# EasyEDA Pro project ProProject_audio_project_2024-04-28.epro

# Schematic Schematic1
Create Date: 2024-04-14; Page Name: P1; Project Name: audio_project; Schematic Name: Schematic1; Update Date: 2024-04-19; Company: 嘉立创EDA; Page Size: A4; Version: V1.0
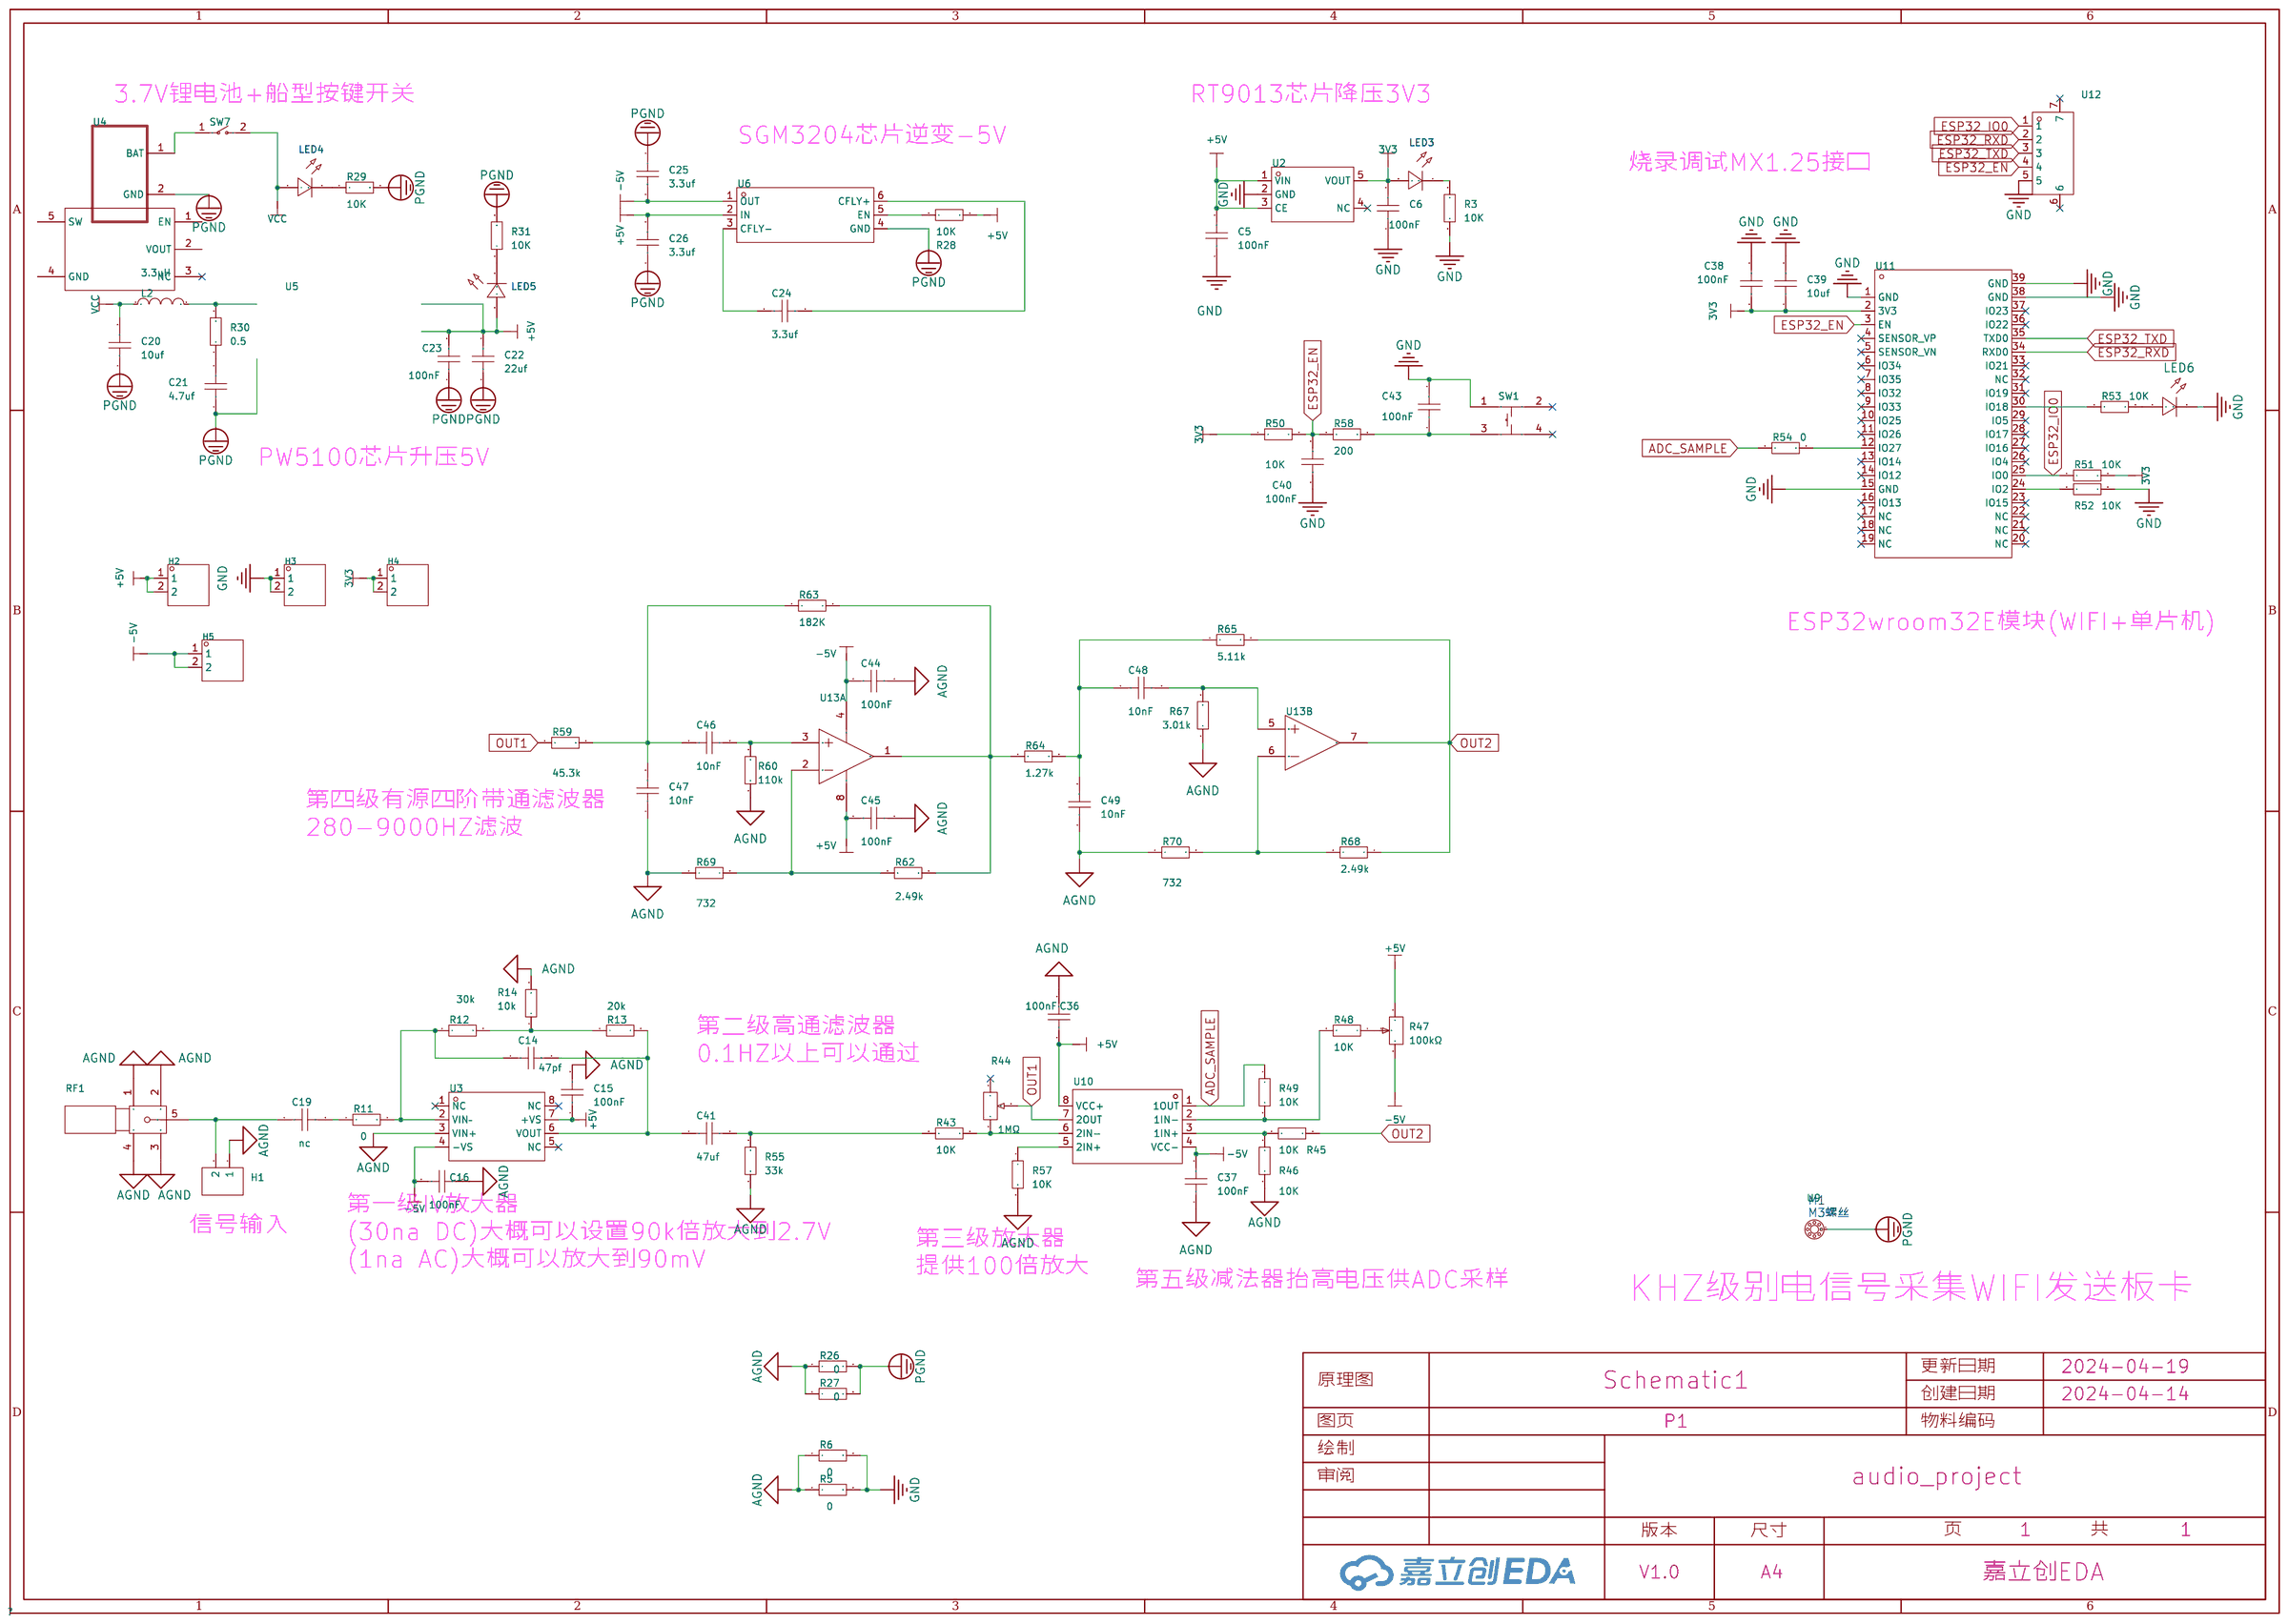
[diagram p0: schematic sheet]

## Parts
C5  100nF  [C0603]
C6  100nF  [C0603]
C14  47pf  [C0603]
C15  100nF  [C0603]
C16  100nF  [C0603]
C19  nc  [C0603]
C20  10uf  [C0805]
C21  4.7uf  [C0603]
C22  22uf  [C0805]
C23  100nF  [C0603]
C24  3.3uf  [C0603]
C25  3.3uf  [C0603]
C26  3.3uf  [C0603]
C36  100nF  [C0603]
C37  100nF  [C0603]
C38  100nF  [C0603]
C39  10uf  [C0805]
C40  100nF  [C0603]
C41  47uf  [C0805]
C43  100nF  [C0603]
C44  100nF  [C0603]
C45  100nF  [C0603]
C46  10nF  [C0603]
C47  10nF  [C0603]
C48  10nF  [C0603]
C49  10nF  [C0603]
H1  -  [HDR-TH_2P-P2.54-V-F]
H2  -  [HDR-TH_2P-P2.54-V-M-1]
H3  -  [HDR-TH_2P-P2.54-V-M-1]
H4  -  [HDR-TH_2P-P2.54-V-M-1]
H5  -  [HDR-TH_2P-P2.54-V-M-1]
L2  3.3uH  [IND-SMD_L4.0-W4.0_FNR40XXS]
LED3  -  [LED_0805]
LED4  -  [LED_0805]
LED5  -  [LED_0805]
LED6  -  [LED_0805]
R3  10K  [R0603]
R5  0  [R0603]
R6  0  [R0603]
R11  0  [R0603]
R12  30k  [R0603]
R13  20k  [R0603]
R14  10k  [R0603]
R26  0  [R0603]
R27  0  [R0603]
R28  10K  [R0603]
R29  10K  [R0603]
R30  0.5  [R0603]
R31  10K  [R0603]
R43  10K  [R0603]
R44  1MΩ  [RES-ADJ-TH_3P-L7.1-W6.9-P2.50-L_3362P]
R45  10K  [R0603]
R46  10K  [R0603]
R47  100kΩ  [RES-ADJ-TH_3296W]
R48  10K  [R0603]
R49  10K  [R0603]
R50  10K  [R0603]
R51  10K  [R0603]
R52  10K  [R0603]
R53  10K  [R0603]
R54  0  [R0603]
R55  33k  [R0603]
R57  10K  [R0603]
R58  200  [R0603]
R59  45.3k  [R0603]
R60  110k  [R0603]
R62  2.49k  [R0603]
R63  182K  [R0603]
R64  1.27k  [R0603]
R65  5.11k  [R0603]
R67  3.01k  [R0603]
R68  2.49k  [R0603]
R69  732  [R0805]
R70  732  [R0805]
RF1  BWSMA-KWE-Z001  [SMA-TH_BWSMA-KWE-Z001]
SW1  K2-1808SN-A3SW-01  [SW-SMD_4P-L4.2-W3.3-P2.15-LS5.1]
SW7  KCD11-2P-R  [SW-TH_2P-L15.0-W10.5-P5.00_KCD11-2P-R]
U2  RT9013-33GB-MS  [SOT-23-5_L2.9-W1.6-P0.95-LS2.8-BR]
U3  OPA657U  [SOIC-8_L4.9-W3.9-P1.27-LS6.0-TL]
U4  -  [两个焊盘]
U5  3c0bada92d29401ea73ee46ec49cffd6  [SOT-23-5_L2.9-W1.6-P0.95-LS2.8-TL]
U6  SGM3204YN6G/TR  [SOT-23-6_L2.9-W1.6-P0.95-LS2.8-BR]
U9  -  [m3]
U10  LF353DR  [SOIC-8_L5.0-W4.0-P1.27-LS6.0-BL]
U11  ESP32-WROOM-32E  [WIFI-SMD_ESP32-WROOM-32E-A]
U12  ZX-MX1.25-5PLT  [CONN-SMD_5P-P1.25_MEGASTAR_ZX-MX1.25-5PLT]
U13  OPA2182IDR  [SOIC-8_L4.9-W3.9-P1.27-LS6.0-BL]  (sections 1,2)

## Library data of the parts
C5 C6 C14-C16 C19 C21 C23-C26 C36-C38 C40 C43-C49 = CAP_0603: Supplier Footprint: 0603
C20 C22 C39 C41 = CAP_0805: Supplier Footprint: 0805
H1 = HDR-F_2.54_1x2P: Supplier Part: C49661; Supplier Footprint: 插件
H2-H5 = HDR-M_2.54_1x2P: Supplier Part: C124375; Supplier Footprint: 插件
L2 = FNR4030S3R3MT: 电感值:3.3uH;精度:±20%;额定电流:2.6A;饱和电流(Isat):3.6A;; LCSC Part Name: 3.3uH ±20% 3.6A; Supplier Part: C167870; Manufacturer: cjiang(长江微电); Supplier Footprint: SMD,4x4mm; JLCPCB Part Class: 扩展库; Datasheet: https://atta.szlcsc.com/upload/public/pdf/source/20190327/C167925_9EFF0AABC4CA629C2CC95961DBF7D39D.pdf; Supplier: LCSC; Tolerance: ±20%; Rated Current: 2.6A; Saturation Current (Isat): 3.6A; DC Resistance (DCR): 52mΩ
LED3-LED5 = LED_0805-G: Supplier Footprint: 0805
LED6 = LED_0805-R: Supplier Footprint: 0805
R3 R5 R6 R11-R14 R26-R31 R43 R45 R46 R48-R55 R57-R60 R62-R65 R67 R68 = Res_0603: Supplier Footprint: 0603
R44 = 3362P-1-105: 阻值:1MΩ;精度:±10%;; LCSC Part Name: 1MΩ ±10%; Supplier Part: C118945; Manufacturer: BOCHEN(博晨); Supplier Footprint: 插件; JLCPCB Part Class: 扩展库; Datasheet: https://atta.szlcsc.com/upload/public/pdf/source/20171114/C118945_15106326627791117434.pdf; Supplier: LCSC; Tolerance: ±10%
R47 = 3296W-1-104LF: 阻值:100kΩ;精度:±10%;; LCSC Part Name: 100kΩ ±10%; Supplier Part: C48084; Manufacturer: BOURNS; Supplier Footprint: 插件; JLCPCB Part Class: 扩展库; Datasheet: https://atta.szlcsc.com/upload/public/pdf/source/20150811/1457707339453.pdf; Supplier: LCSC; Tolerance: ±10%
R69 R70 = Res_0805: Supplier Footprint: 0805
RF1 = BWSMA-KWE-Z001: 连接器类型:板端;接口类型:内孔;端口数量:1;接口直径:5.3mm;接口长度/高度:-;频率-最大值:-;射频系列:SMA;阻抗:50Ω;样式:弯头;触头材质:-;触头镀层:-;工作温度范围:-;焊接温度(最大值):-;; LCSC Part Name: 内孔 SMA 弯头; Supplier Part: C496551; Manufacturer: BAT WIRELESS(蝙蝠无线); Supplier Footprint: 插件; JLCPCB Part Class: 扩展库; Datasheet: https://atta.szlcsc.com/upload/public/pdf/source/20231017/997A8C2ADA7F8034A89BE1264F38CE52.pdf; Supplier: LCSC; Connector Type: 板端; Interface Type: 内孔; Number of Ports: 1; Interface Diameter: 5.3mm; RF Series: SMA; Impedance: 50Ω; Style: 弯头
SW1 = K2-1808SN-A3SW-01: 触点电流:50mA;额定电压(DC):12V;绝缘电阻:100MΩ;安装方式:立贴;作用力:180gf@±30gf;机械寿命:100000;工作温度:-25℃~+85℃;开关长度:4.2mm;开关宽度:3.25mm;开关高度:2.5mm;; LCSC Part Name: 3*4*2.5 贴片开关180G; Supplier Part: C2690012; Manufacturer: 韩国韩荣; Supplier Footprint: SMD; JLCPCB Part Class: 扩展库; Datasheet: https://atta.szlcsc.com/upload/public/pdf/source/20180927/C283535_7E7907F3E7B6C1691E1DC87E363D082A.pdf; Supplier: LCSC; Contact Current: 50mA; Voltage Rating (DC): 12V; Insulation Resistance: 100MΩ; Mounting Sytle: 立贴; Operating Force: 180gf@±30gf; Mechanical Life: 100000; Operating Temperature: -25℃~+85℃; Switch Length: 4.2mm; Switch Width: 3.25mm; Switch Height: 2.5mm
SW7 = KCD11-2P-R: 带灯:无;引脚样式:焊片;额定电流:3A;额定电压(AC):250V;额定电压(DC):-;电路结构:单刀单掷;机械寿命:1万次;; LCSC Part Name: 10.5*15mm 两脚两档跷板开关 红钮; Supplier Part: C5884414; Manufacturer: SHOU HAN(首韩); Supplier Footprint: 插件; JLCPCB Part Class: 扩展库; Datasheet: https://atta.szlcsc.com/upload/public/pdf/source/20230506/CD06DFDE35C8048D34175BFF4AF6A2C2.pdf; Supplier: LCSC; Switch Length: 15mm; Switch Width: 10.5mm; Switch Height: 17.2mm; Actuator Type: 凹面弯曲; With Lamp: 无; Pin Style: 焊片; Actuator Color: 红色; Contact Current: 3A; Voltage Rating (AC): 250V; Circuit: 单刀单掷; Mechanical Life: 1万次; Operating Temperature: 0℃~+125℃; Actuator Identifier: - O
U2 = RT9013-33GB-MS: 输出类型:固定;最大输入电压:5.5V;输出电压:3.3V;输出电流:500mA;电源纹波抑制比(PSRR):75dB@(1kHz);输出极性:正极;; Supplier Part: C7434207; Manufacturer: MSKSEMI(美森科); Supplier Footprint: SOT-23-5; JLCPCB Part Class: 扩展库; Datasheet: https://atta.szlcsc.com/upload/public/pdf/source/20230705/1D6536D82D93AC1E044F3DAE104751D9.pdf; Supplier: LCSC; Output Type: 固定; Maximum Input Voltage: 5.5V; Output Voltage: 3.3V; Output Current: 500mA; Power Supply Rejection Ratio (PSRR): 75dB@(1kHz); Output Polarity: 正极
U3 = OPA657U: 1.6GHz、低噪声、FET 输入运算放大器 8-SOIC -40 to 85; Supplier Part: C2878144; Manufacturer: TI(德州仪器); Supplier Footprint: SOIC-8; JLCPCB Part Class: 扩展库; Supplier: LCSC
U4 = 两个焊盘
U5 = PW5100: 锂电池DC-DC高效同步升压变换器
U6 = SGM3204YN6G/TR: 功能类型:电荷泵;输入电压:1.4V~5.5V;输出电压:-5.5V~-1.4V;输出电流(最大值):200mA;; Supplier Part: C194031; Manufacturer: SGMICRO(圣邦微); Supplier Footprint: SOT-23-6; JLCPCB Part Class: 扩展库; Datasheet: https://atta.szlcsc.com/upload/public/pdf/source/20180627/C194031_755051E53122D645C36CF727711B963E.pdf; Supplier: LCSC; Function: 电荷泵; Input Voltage: 1.4V~5.5V; Output Voltage: -5.5V~-1.4V; Output Current (Max): 200mA; Switching Frequency: 950kHz; Number of Outputs: 1
U9 = M3焊盘
U10 = LF353DR: 运放类型:J-FET;放大器组数:2;增益带宽积（GBP）:3MHz;压摆率（SR）:13 V/us;电源电压:±3.5V ~ 18V;各通道供电电流:3.6mA;; Supplier Part: C7918; Manufacturer: TI(德州仪器); Supplier Footprint: SOIC-8-150mil; JLCPCB Part Class: 扩展库; Datasheet: https://atta.szlcsc.com/upload/public/pdf/source/20180308/C7918_15204885487891413793.pdf; Supplier: LCSC; Amplifier Type: J-FET; Number of Circuits: 2; Gain Bandwidth Product（GBP）: 3MHz; Slew Rate（SR）: 13 V/us; Supply Voltage（Single）: ±3.5V ~ 18V; Iq per channel (Typ): 3.6mA; Operating Temperature: 0°C ~ 70°C
U11 = ESP32-WROOM-32E: Supplier Part: C2973652; Manufacturer: ESPRESSIF(乐鑫); Supplier Footprint: SMD,18x25.5mm; JLCPCB Part Class: Extended Part; Datasheet: https://atta.szlcsc.com/upload/public/pdf/source/20220506/2B7DF1E5B41DABC7447F735C715CAF22.pdf; Supplier: LCSC
U12 = ZX-MX1.25-5PLT: 插针结构:1x5P;间距:1.25mm;安装方式:立贴;参考系列:-;总PIN数:5P;排数:1;每排PIN数:5;行距:-;额定电流:1A;触头材质:黄铜;触头镀层:锡;工作温度范围:-25℃~+85℃;; LCSC Part Name: 1x5P 间距:1.25mm 立贴; Supplier Part: C7430476; Manufacturer: Megastar(兆星); Supplier Footprint: SMD,P=1.25mm; JLCPCB Part Class: 扩展库; Datasheet: https://atta.szlcsc.com/upload/public/pdf/source/20230619/51DE3896F53EA722A95969B8F38DD13F.pdf; Supplier: LCSC; Pins Structure: 1x5P; Pitch: 1.25mm; Mounting Style: 立贴; Number of Pins: 5P; Number of Rows: 1; Number of PINs Per Row: 5; Current Rating (Max): 1A; Contact Material: 黄铜; Contact Plating: 锡; Operating Temperature Range: -25℃~+85℃
U13 = OPA2182IDR: 放大器数:双路;增益带宽积(GBP):5MHz;输入偏置电流(Ib):50pA;输入失调电压(Vos):450nV;压摆率(SR):10V/us;带宽(-3db):-;轨到轨:-;; Supplier Part: C2873420; Manufacturer: TI(德州仪器); Supplier Footprint: SOIC-8; JLCPCB Part Class: 扩展库; Datasheet: https://www.ti.com/cn/lit/gpn/opa2182; Supplier: LCSC; Number of Circuits: 双路; Gain Bandwidth Product(GBP): 5MHz; Current - Input Bias(Ib): 50pA; Voltage - Input Offset(Vos): 450nV; Slew Rate(SR): 10V/us; Operating Temperature: -40℃~+125℃

## Nets
3V3: C6.2 C38.2 C39.1 H4.1 H4.2 LED3.2(A) R50.1 R51.2 U2.5(VOUT) U11.2(3V3)
+5V: C5.2 C15.1 C22.2 C23.2 C26.2 C36.1 C45.2 H2.1 H2.2 LED5.2(A) R28.2 R47.1 U2.1(VIN) U2.3(CE) U3.7(+VS) U6.2(IN) U10.8(VCC+) U13.8(V+)
-5V: C16.2 C25.2 C37.2 C44.2 H5.1 H5.2 R47.3 U3.4(-VS) U6.1(OUT) U10.4(VCC-) U13.4(V-)
AGND: C15.2 C16.1 C36.2 C37.1 C44.1 C45.1 C47.1 C49.1 H1.1 R5.1 R6.1 R14.2 R26.1 R27.1 R46.1 R55.1 R57.2 R60.1 R67.1 R69.1 R70.1 RF1.1 RF1.2 RF1.3 RF1.4 U3.3(VIN+)
GND: C5.1 C6.1 C38.1 C39.2 C40.1 C43.2 H3.1 H3.2 LED6.1(C) R3.2 R5.2 R6.2 R52.2 SW1.1 U2.2(GND) U11.1(GND) U11.15(GND) U11.38(GND) U11.39(GND) U12.5
PGND: C20.1 C21.1 C22.1 C23.1 C25.1 C26.1 R26.2 R27.2 R29.2 R31.2 U4.2(GND) U6.4(GND) U9.1
VCC: C20.2 L2.1 LED4.2(A) SW7.2
ADC_SAMPLE: R49.1 R54.1 U10.1(1OUT)
ESP32_EN: C40.2 R50.2 R58.1 U11.3(EN) U12.4
ESP32_IO0: R51.1 U11.25(IO0) U12.1
ESP32_RXD: U11.34(RXD0) U12.2
ESP32_TXD: U11.35(TXD0) U12.3
OUT1: R44.2 R59.1 U10.7(2OUT)
OUT2: R45.2 R65.2 R68.1 U13.7(OUT B)
$1N488: R12.2 R13.1 R14.1
$1N489: C14.1 R11.2 R12.1 U3.2(VIN–)
$1N495: C19.2 R11.1
$1N540: C19.1 H1.2 RF1.5
$1N708: LED4.1(C) R29.1
$1N711: SW7.1 U4.1(BAT)
$1N1130: C21.2 R30.1
$1N1484: C24.2 U6.3(CFLY-)
$1N1485: C24.1 U6.6(CFLY+)
$1N1490: R28.1 U6.5(EN)
$1N1557: LED5.1(C) R31.1
$1N1776: LED3.1(C) R3.1
$1N5623: R43.1 R44.3 U10.6(2IN-)
$1N5830: R45.1 R46.2 U10.3(1IN+)
$1N5955: R47.2 R48.1
$1N5959: R48.2 R49.2 U10.2(1IN-)
$1N8059: R52.1 U11.24(IO2)
$1N8471: R53.1 U11.30(IO18)
$1N8523: LED6.2(A) R53.2
$1N8889: R54.2 U11.12(IO27)
$1N15972: C14.2 C41.1 R13.2 U3.6(VOUT)
$1N16222: R57.1 U10.5(2IN+)
$1N16765: C43.1 R58.2 SW1.3
$1N16886: C41.2 R43.2 R55.2
$1N17273: C46.2 R60.2 U13.3(IN A+)
$1N17414: R62.1 R69.2 U13.2(IN A-)
$1N17487: C46.1 C47.2 R59.2 R63.1
$1N17494: R62.2 R63.2 R64.1 U13.1(OUT A)
$1N17602: C48.1 C49.2 R64.2 R65.1
$1N17715: C48.2 R67.2 U13.5(IN B+)
$1N17735: R68.2 R70.2 U13.6(IN B-)
Net-(L2-2): L2.2 R30.2

Not connected (* = marked no-connect by the designer): R44 1*; SW1 2* 4*; U2 4(NC)*; U3 1(NC)* 5(NC)* 8(NC)*; U5 1(EN) 2(VOUT) 3(NC)* 4(GND) 5(SW); U11 4(SENSOR_VP)* 5(SENSOR_VN)* 6(IO34)* 7(IO35)* 8(IO32)* 9(IO33)* 10(IO25)* 11(IO26)* 13(IO14)* 14(IO12)* 16(IO13)* 17(NC)* 18(NC)* 19(NC)* 20(NC)* 21(NC)* 22(NC)* 23(IO15)* 26(IO4)* 27(IO16)* 28(IO17)* 29(IO5)* 31(IO19)* 32(NC)* 33(IO21)* 36(IO22)* 37(IO23)*; U12 6* 7*

## Notes on the sheet
- 3.7V锂电池+船型按键开关
- RT9013芯片降压3V3
- SGM3204芯片逆变-5V
- 烧录调试MX1.25接口
- PW5100芯片升压5V
- ESP32wroom32E模块(WIFI+单片机)
- 第四级有源四阶带通滤波器
  280-9000HZ滤波
- 第二级高通滤波器
  0.1HZ以上可以通过
- 信号输入
- 第一级IV放大器
  (30na DC)大概可以设置90k倍放大到2.7V
  (1na AC)大概可以放大到90mV
- 第三级放大器
  提供100倍放大
- 第五级减法器抬高电压供ADC采样
- KHZ级别电信号采集WIFI发送板卡

# Board PCB1
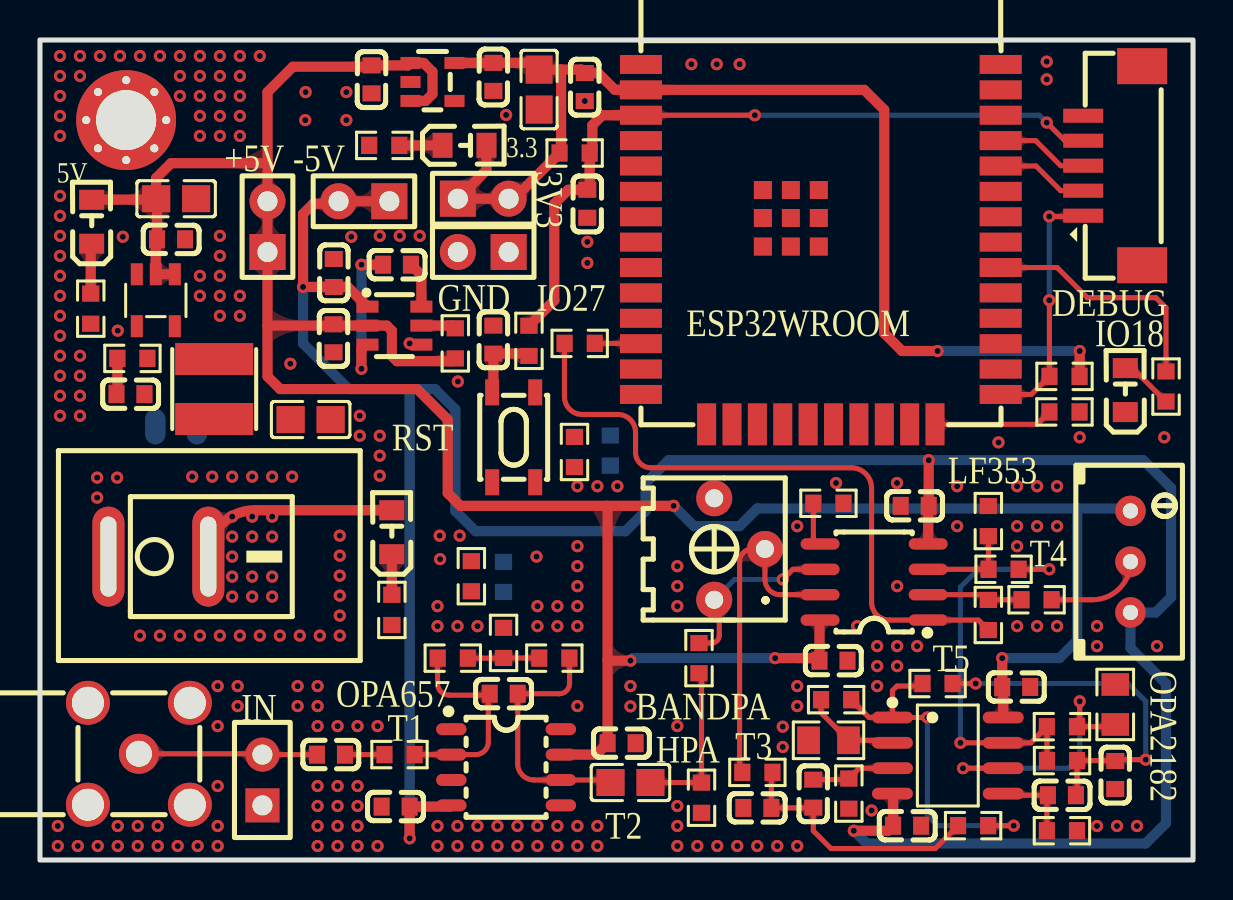
[diagram p1: board, top side]
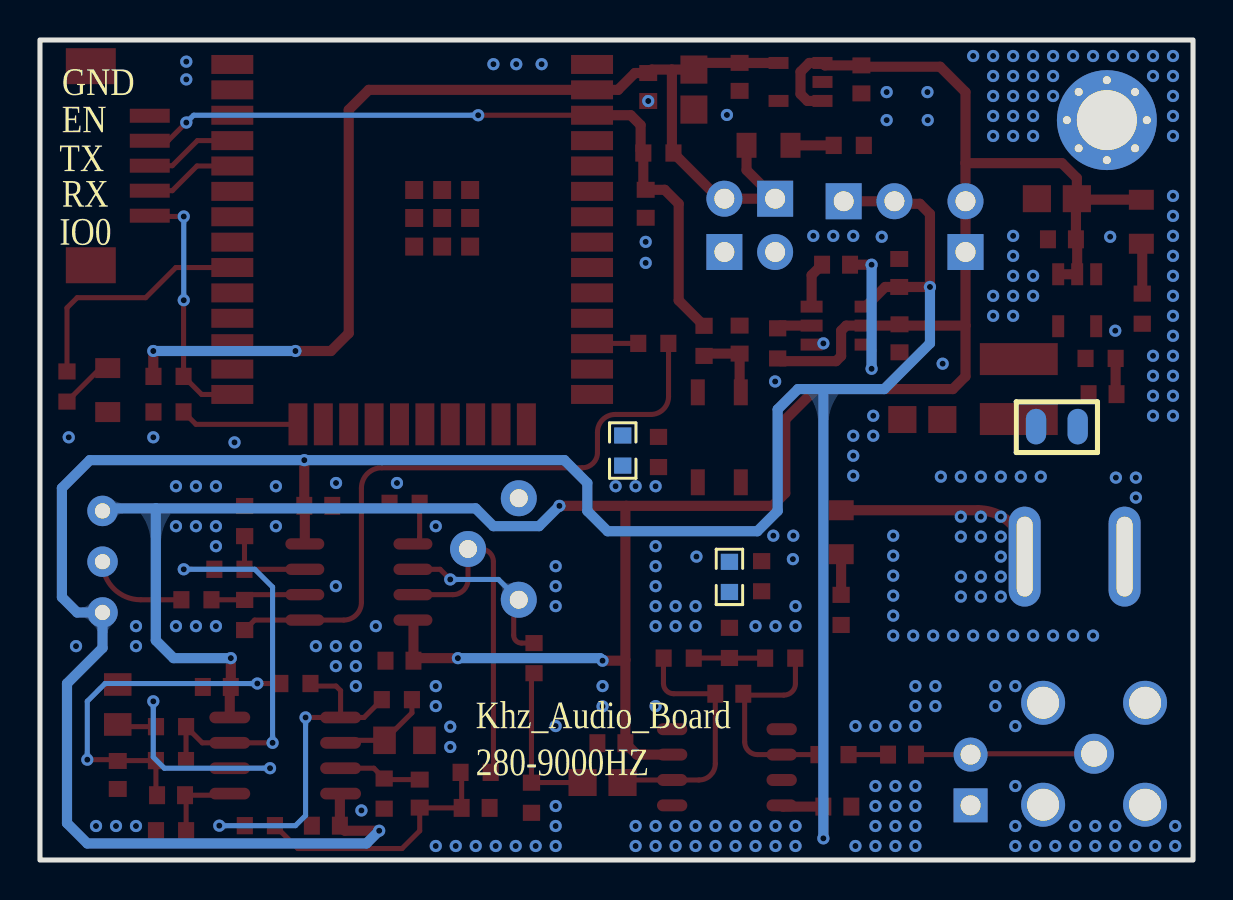
[diagram p2: board, bottom side, seen from below]

Outline 57.7 x 41.03 mm; copper layers: Top Layer, Bottom Layer. Coordinates in mm from the lower left corner of the outline.
Outline path: rectangle 0,0 57.7,41.03
Stack: Top Layer 0.035mm / Dielectric1 1.51mm FR4 er 4.5 / Bottom Layer 0.035mm

## Design rules (mm)
template: 自定义配置
spacing copperThickness1oz (default): track to track 0.102, other pairs 0.152 to 0.3
spacing copperThickness2oz: track to track 0.203, other pairs 0.152 to 0.3
track width copperThickness1oz (default): min 0.127, default 0.254, max 2.54
track width copperThickness2oz: min 0.203, default 0.254, max 2.54
differential pair differentialPair (default): width min 0.127, default 0.254, max 2.54; gap min 0.152, default 0.152
via viaSize (default): diameter min 0.5, default 0.61, max 10; hole min 0.3, default 0.305, max 6.3

## Placement (name value [footprint] x y rotation side)
C5  100nF  [C0603]  16.59 39.06 90 top
C6  100nF  [C0603]  22.69 39.18 90 top
C14  47pf  [C0603]  23.2 8.32 0 top
C15  100nF  [C0603]  29.1 5.84 0 top
C16  100nF  [C0603]  17.8 2.67 0 top
C19  nc  [C0603]  14.56 5.27 0 top
C20  10uf  [C0805]  13.54 22.04 180 top
C21  4.7uf  [C0603]  4.53 23.31 180 top
C22  22uf  [C0805]  6.81 33.09 180 top
C23  100nF  [C0603]  6.56 31.06 180 top
C24  3.3uf  [C0603]  17.86 29.79 180 top
C25  3.3uf  [C0603]  14.7 29.37 270 top
C26  3.3uf  [C0603]  14.69 26.1 90 top
C36  100nF  [C0603]  39.71 9.97 0 top
C37  100nF  [C0603]  43.77 17.72 0 top
C38  100nF  [C0603]  27.26 38.68 90 top
C39  10uf  [C0805]  24.97 38.55 270 top
C40  100nF  [C0603]  27.39 32.83 90 top
C41  47uf  [C0805]  29.55 3.88 0 top
C43  100nF  [C0603]  22.69 26.04 90 top
C44  100nF  [C0603]  43.39 1.72 180 top
C45  100nF  [C0603]  48.85 8.66 180 top
C46  10nF  [C0603]  38.69 3.32 90 top
C47  10nF  [C0603]  35.9 2.61 0 top
C48  10nF  [C0603]  51.14 3.24 180 top
C49  10nF  [C0603]  53.8 4.26 90 top
H1  -  [HDR-TH_2P-P2.54-V-F]  11.13 4 90 top
H2  -  [HDR-TH_2P-P2.54-V-M-1]  11.39 31.69 90 top
H3  -  [HDR-TH_2P-P2.54-V-M-1]  22.18 30.42 180 top
H4  -  [HDR-TH_2P-P2.54-V-M-1]  22.18 33.09 0 top
H5  -  [HDR-TH_2P-P2.54-V-M-1]  16.21 32.96 180 top
L2  3.3uH  [IND-SMD_L4.0-W4.0_FNR40XXS]  8.72 23.56 90 top
LED3  -  [LED_0805]  21.29 35.75 0 top
LED4  -  [LED_0805]  17.61 16.45 90 top
LED5  -  [LED_0805]  2.59 31.98 90 top
LED6  -  [LED_0805]  54.31 23.56 90 top
R3  10K  [R0603]  17.23 35.75 180 top
R5  0  [R0603]  28.54 20.49 90 bottom
R6  0  [R0603]  26.75 20.42 90 top
R11  0  [R0603]  17.99 5.27 0 top
R12  30k  [R0603]  20.66 10.1 0 top
R13  20k  [R0603]  25.74 10.1 0 top
R14  10k  [R0603]  23.2 10.86 90 top
R26  0  [R0603]  21.58 14.2 90 top
R27  0  [R0603]  23.2 14.16 90 bottom
R28  10K  [R0603]  20.78 25.85 270 top
R29  10K  [R0603]  17.61 12.51 270 top
R30  0.5  [R0603]  4.63 25.1 0 top
R31  10K  [R0603]  2.54 27.59 270 top
R43  10K  [R0603]  32.98 10.1 270 top
R44  1MΩ  [RES-ADJ-TH_3P-L7.1-W6.9-P2.50-L_3362P]  35.01 15.56 270 top
R45  10K  [R0603]  48.21 14.55 0 top
R46  10K  [R0603]  47.45 16.96 270 top
R47  100kΩ  [RES-ADJ-TH_3296W]  54.57 14.93 0 top
R48  10K  [R0603]  49.87 13.02 180 top
R49  10K  [R0603]  47.45 12.26 90 top
R50  10K  [R0603]  26.75 35.37 0 top
R51  10K  [R0603]  51.26 24.2 0 top
R52  10K  [R0603]  51.26 22.42 0 top
R53  10K  [R0603]  56.34 23.69 270 top
R54  0  [R0603]  27.01 25.85 0 top
R55  33k  [R0603]  33.1 3.12 90 top
R57  10K  [R0603]  39.45 17.85 0 top
R58  200  [R0603]  24.47 25.98 270 top
R59  45.3k  [R0603]  35.9 4.39 0 top
R60  110k  [R0603]  40.47 3.32 90 top
R62  2.49k  [R0603]  39.84 8.02 0 top
R63  182K  [R0603]  46.69 1.72 0 top
R64  1.27k  [R0603]  44.91 8.83 0 top
R65  5.11k  [R0603]  51.14 4.97 180 top
R67  3.01k  [R0603]  51.14 1.46 180 top
R68  2.49k  [R0603]  51.14 6.67 0 top
R69  732  [R0805]  39.46 5.99 0 top
R70  732  [R0805]  53.8 7.78 270 top
RF1  BWSMA-KWE-Z001  [SMA-TH_BWSMA-KWE-Z001]  4.95 5.32 180 top
SW1  K2-1808SN-A3SW-01  [SW-SMD_4P-L4.2-W3.3-P2.15-LS5.1]  23.7 21.15 270 top
SW7  KCD11-2P-R  [SW-TH_2P-L15.0-W10.5-P5.00_KCD11-2P-R]  5.92 15.18 0 top
U2  RT9013-33GB-MS  [SOT-23-5_L2.9-W1.6-P0.95-LS2.8-BR]  19.64 38.93 180 top
U3  OPA657U  [SOIC-8_L4.9-W3.9-P1.27-LS6.0-TL]  23.32 4.64 0 top
U4  -  [两个焊盘]  4.53 20.01 90 bottom
U5  3c0bada92d29401ea73ee46ec49cffd6  [SOT-23-5_L2.9-W1.6-P0.95-LS2.8-TL]  5.8 28.01 270 top
U6  SGM3204YN6G/TR  [SOT-23-6_L2.9-W1.6-P0.95-LS2.8-BR]  17.73 26.74 180 top
U9  -  [m3]  4.31 37.02 0 top
U10  LF353DR  [SOIC-8_L5.0-W4.0-P1.27-LS6.0-BL]  41.74 13.91 90 top
U11  ESP32-WROOM-32E  [WIFI-SMD_ESP32-WROOM-32E-A]  39.07 30.8 0 top
U12  ZX-MX1.25-5PLT  [CONN-SMD_5P-P1.25_MEGASTAR_ZX-MX1.25-5PLT]  53.68 34.74 90 top
U13  OPA2182IDR  [SOIC-8_L4.9-W3.9-P1.27-LS6.0-BL]  45.43 5.23 270 top

## Footprints (pads in the part's own frame, mm; a bottom-side part is the same pattern mirrored in y, then rotated)
C0603
  rect 0.8x0.9 smd: 1(-0.7,0) 2(0.7,0)
C0805
  rect 1.41x1.35 smd: 1(-1,0) 2(1,0)
CONN-SMD_5P-P1.25_MEGASTAR_ZX-MX1.25-5PLT
  rect 0.7x2 smd: 1(-2.5,1.475) 2(-1.25,1.475) 3(0,1.475) 4(1.25,1.475) 5(2.5,1.475)
  rect 1.8x2.5 smd: 6(4.98,-1.475) 7(-4.98,-1.475)
HDR-TH_2P-P2.54-V-F
  rect 1.7x1.7 hole 1: 1(-1.27,0)
  round 1.7 hole 1: 2(1.27,0)
HDR-TH_2P-P2.54-V-M-1
  rect 1.8x1.8 hole 1: 1(-1.27,0)
  round 1.8 hole 1: 2(1.27,0)
IND-SMD_L4.0-W4.0_FNR40XXS
  rect 1.6x3.9 smd: 1(-1.5,0) 2(1.5,0)
LED_0805
  rect 1x1.25 smd: 1(-1.15,0.005) 2(1.05,0.005)
m3
  round 0.6 hole 0.405x0.4: 1(-2,0) 1(-1.41,1.41) 1(-1.41,-1.41) 1(0,2) 1(0,-2) 1(1.41,1.41) 1(1.41,-1.41) 1(2,0)
  round 5 hole 3.005x3: 1(0,0)
R0603
  rect 0.806x0.864 smd: 1(-0.753,0) 2(0.753,0)
R0805
  rect 1.133x1.377 smd: 1(-1,0) 2(1,0)
RES-ADJ-TH_3P-L7.1-W6.9-P2.50-L_3362P
  round 1.8 hole 0.9: 1(-2.54,-1.27) 2(0,1.27) 3(2.54,-1.27)
RES-ADJ-TH_3296W
  round 1.524 hole 0.762: 1(0,2.54) 2(0,0) 3(0,-2.54)
SMA-TH_BWSMA-KWE-Z001
  round 2.2 hole 1.6: 1(-2.55,-2.55) 2(-2.55,2.55) 3(2.55,2.55) 4(2.55,-2.55)
  round 2 hole 1.3: 5(0,0)
SOIC-8_L4.9-W3.9-P1.27-LS6.0-BL
  oval 0.588x2.045 smd: 1(-1.905,-2.772) 2(-0.635,-2.772) 3(0.635,-2.772) 4(1.905,-2.772) 5(1.905,2.772) 6(0.635,2.772) 7(-0.635,2.772) 8(-1.905,2.772)
SOIC-8_L4.9-W3.9-P1.27-LS6.0-TL
  oval 1.52x0.6 smd: 1(-2.74,1.905) 2(-2.74,0.635) 3(-2.74,-0.635) 4(-2.74,-1.905) 5(2.74,-1.905) 6(2.74,-0.635) 7(2.74,0.635) 8(2.74,1.905)
SOIC-8_L5.0-W4.0-P1.27-LS6.0-BL
  oval 0.569x1.95 smd: 1(-1.905,-2.705) 2(-0.635,-2.705) 3(0.635,-2.705) 4(1.905,-2.705) 5(1.905,2.705) 6(0.635,2.705) 7(-0.635,2.705) 8(-1.905,2.705)
SOT-23-5_L2.9-W1.6-P0.95-LS2.8-BR
  rect 1x0.6 smd: 1(1.1,-0.95) 2(1.1,0) 3(1.1,0.95) 4(-1.1,0.95) 5(-1.1,-0.95)
SOT-23-5_L2.9-W1.6-P0.95-LS2.8-TL
  rect 1.1x0.6 smd: 1(-1.3,0.95) 2(-1.3,0) 3(-1.3,-0.95) 4(1.3,-0.95) 5(1.3,0.95)
SOT-23-6_L2.9-W1.6-P0.95-LS2.8-BR
  rect 1.1x0.6 smd: 1(1.35,-0.95) 2(1.35,0) 3(1.35,0.95) 4(-1.35,0.95) 5(-1.35,0) 6(-1.35,-0.95)
SW-SMD_4P-L4.2-W3.3-P2.15-LS5.1
  rect 1.3x0.7 smd: 1(-2.25,1.075) 2(2.25,1.075) 3(-2.25,-1.075) 4(2.25,-1.075)
SW-TH_2P-L15.0-W10.5-P5.00_KCD11-2P-R
  oval 1.6x5 hole 0.8x4: 1(-2.5,0) 2(2.5,0)
WIFI-SMD_ESP32-WROOM-32E-A
  rect 2.1x0.95 smd: 1(-9,9.002) 2(-9,7.732) 3(-9,6.463) 4(-9,5.192) 5(-9,3.922) 6(-9,2.652) 7(-9,1.383) 8(-9,0.113) 9(-9,-1.157) 10(-9,-2.428) 11(-9,-3.697) 12(-9,-4.968) 13(-9,-6.237) 14(-9,-7.508) 25(9,-7.508) 26(9,-6.237) 27(9,-4.968) 28(9,-3.697) 29(9,-2.428) 30(9,-1.157) 31(9,0.113) 32(9,1.383) 33(9,2.652) 34(9,3.922) 35(9,5.192) 36(9,6.463) 37(9,7.732) 38(9,9.002)
  rect 0.95x2.1 smd: 15(-5.715,-9.002) 16(-4.444,-9.002) 17(-3.175,-9.002) 18(-1.905,-9.002) 19(-0.634,-9.002) 20(0.635,-9.002) 21(1.905,-9.002) 22(3.175,-9.002) 23(4.446,-9.002) 24(5.715,-9.002)
  rect 0.9x0.9 smd: 39(-2.9,2.721) 39(-2.9,1.321) 39(-2.9,-0.108) 39(-1.5,2.721) 39(-1.5,1.321) 39(-1.5,-0.108) 39(-0.1,2.721) 39(-0.1,1.321) 39(-0.1,-0.108)
两个焊盘
  oval 1.778x1.016 smd: 1(1.677,1.244) 2(1.677,3.328)

## Nets
As in the schematic, except:
+5V: C5.2 C15.1 C22.2 C23.2 C26.2 C36.1 C45.2 H2.1 H2.2 LED5.2 R28.2 R47.1 U2.1 U2.3 U3.7 U5.1 U5.2 U6.2 U10.8 U13.8
PGND: C20.1 C21.1 C22.1 C23.1 C25.1 C26.1 R26.2 R27.2 R29.2 R31.2 U4.2 U5.4 U6.4 U9.1
$1N1033: L2.2 R30.2 U5.5

Pads without a net: R44 1; SW1 2 4; U2 4; U3 1 5 8; U5 3; U11 4 5 6 7 8 9 10 11 13 14 16 17 18 19 20 21 22 23 26 27 28 29 31 32 33 36 37; U12 6 7

## Via types
v1: diameter 0.61, hole 0.305, Top Layer to Bottom Layer, 47 vias
v2: diameter 0.61, hole 0.304, Top Layer to Bottom Layer, 229 vias

## Routing (per net, layer and track width the routed paths; a pad name or vN(x,y) marks a point on that pad's centre or on a via; arc(x,y) is an arc through that point)
3V3: length 58.6
  Top Layer w0.508: v1(52.02,25.47) 52.02,24.21 R51.2 ; U2.5 22.68,39.88 C6.2 24.64,39.88 C39.1 26.08,39.55 ; 26.08,39.55 26.08,35.45 R50.1 23.71,33.09 H4.2 H4.1 22.34,34.52 22.34,35.76 ; 26.08,39.55 27.09,39.55 C38.2 27.93,39.38 28.77,38.53 U11.2 41.24,38.53 42.25,37.53 42.25,26.36 43.14,25.47 v1(44.91,25.47)
  Bottom Layer w0.508: v1(44.91,25.47) v1(52.02,25.47)
+5V: length 141.4
  Top Layer w0.508: v1(48.15,10.1) C45.2 48.2,8.61 U13.8 ; 28.4,10.01 28.44,9.97 v1(29.55,9.97) ; 28.4,10.01 C15.1 27.83,5.27 U3.7 ; 28.4,10.01 28.4,17.68 28.36,17.72 ; 11.39,34.87 11.39,38.42 12.65,39.69 16.53,39.69 C5.2 18.42,39.76 U2.1 19.2,39.88 19.64,39.44 19.64,38.33 19.29,37.98 U2.3 ; 11.39,34.87 6.56,34.87 5.81,34.12 C22.2 5.86,33.04 ; 11.39,34.87 H2.1 11.39,26.74 ; R28.2 20.65,24.96 17.86,24.96 17.61,25.21 17.61,26.48 17.35,26.74 U6.2 14.75,26.74 C26.2 14.62,26.74 11.39,26.74 ; 28.36,17.72 21.04,17.72 20.4,18.36 20.4,22.04 18.88,23.56 12.02,23.56 11.39,24.2 11.39,26.74 ; 28.36,17.72 v1(31.7,17.72) ; U5.1 U5.2 5.8,30.99 C23.2 5.86,33.04 ; LED5.2 2.59,33.04 5.86,33.04 ; v1(36.79,10.1) 38.88,10.1 C36.1 39.01,11.98 U10.8
  Bottom Layer w0.508: v1(48.15,10.1) 51.01,10.1 51.9,10.99 51.9,17.59 51.89,17.59 ; v1(36.79,10.1) 29.67,10.1 v1(29.55,9.97) ; 51.89,17.59 35.9,17.59 35.01,16.7 32.72,16.7 v1(31.7,17.72) ; 51.89,17.59 54.44,17.59 R47.1
-5V: length 137.4
  Top Layer w0.508: U6.1 15.4,28.67 C25.2 v1(13.16,28.67) 13.16,32.33 13.67,32.83 14.81,32.83 H5.2 H5.1 ; U10.4 44.44,17.69 C37.2 v1(44.47,20.01) ; U13.4 42.69,3.29 C44.2 42.43,1.46 v1(40.72,1.46) ; v1(18.5,1.08) C16.2 20.52,2.67 20.58,2.73
  Bottom Layer w0.508: v1(40.72,1.46) 41.36,0.83 55.33,0.83 56.34,1.85 56.34,8.83 54.57,10.61 R47.3 55.83,12.39 56.6,13.15 56.6,18.61 55.2,20.01 v1(44.47,20.01) 31.45,20.01 30.31,18.86 30.31,17.47 29.29,16.45 21.8,16.45 20.78,17.47 20.78,22.55 19.77,23.56 18.42,23.56 ; v1(18.5,1.08) 18.5,23.48 18.42,23.56 ; 18.42,23.56 15.45,23.56 13.16,25.85 v1(13.16,28.67)
AGND:
  vias: v1(41.61,2.48) v2(0.89,1.7) v2(0.89,0.7) v2(1.89,0.7) v2(2.89,0.7) v2(3.89,1.7) v2(3.89,0.7) v2(4.89,1.7) v2(4.89,0.7) v2(5.89,1.7) v2(5.89,0.7) v2(6.89,0.7) v2(7.89,0.7) v2(8.89,8.7) v2(8.89,6.7) v2(8.89,3.7) v2(8.89,1.7) v2(8.89,0.7) v2(9.89,8.7) v2(9.89,7.7) v2(12.89,8.7) v2(12.89,7.7) v2(13.89,8.7) v2(13.89,7.7) v2(13.89,6.7) v2(13.89,3.7) v2(13.89,2.7) v2(13.89,1.7) v2(13.89,0.7) v2(14.89,6.7) v2(14.89,3.7) v2(14.89,2.7) v2(14.89,1.7) v2(14.89,0.7) v2(15.89,6.7) v2(15.89,3.7) v2(15.89,2.7) v2(15.89,1.7) v2(15.89,0.7) v2(16.89,6.7) v2(16.89,0.7) v2(19.89,12.7) v2(19.89,11.7) v2(19.89,1.7) v2(19.89,0.7) v2(20.89,11.7) v2(20.89,1.7) v2(20.89,0.7) v2(21.89,11.7) v2(21.89,1.7) v2(21.89,0.7) v2(22.89,1.7) v2(22.89,0.7) v2(23.89,1.7) v2(23.89,0.7) v2(24.89,12.7) v2(24.89,11.7) v2(24.89,1.7) v2(24.89,0.7) v2(25.89,12.7) v2(25.89,11.7) v2(25.89,1.7) v2(25.89,0.7) v2(26.89,18.7) v2(26.89,15.7) v2(26.89,14.7) v2(26.89,13.7) v2(26.89,12.7) v2(26.89,11.7) v2(26.89,7.7) v2(26.89,1.7) v2(26.89,0.7) v2(27.89,18.7) v2(27.89,1.7) v2(27.89,0.7) v2(28.89,18.7) v2(29.55,8.7) v2(29.55,7.69) v2(31.89,14.7) v2(31.89,13.7) v2(31.89,12.7) v2(31.89,6.7) v2(31.89,2.7) v2(31.89,1.7) v2(31.89,0.7) v2(32.89,0.7) v2(33.89,0.7) v2(34.89,0.7) v2(35.89,0.7) v2(36.89,0.7) v2(37.17,6.67) v2(37.17,5.66) v2(37.89,16.7) v2(37.89,8.7) v2(37.89,7.7) v2(37.89,0.7) v2(39.83,18.86) v2(40.89,11.7) v2(41.89,10.7) v2(41.89,9.7) v2(41.89,8.7) v2(42.88,18.86) v2(42.89,13.7) v2(42.89,10.7) v2(42.89,9.7) v2(43.89,10.7) v2(45.89,18.7) v2(45.89,16.7) v2(48.89,18.7) v2(48.89,16.7) v2(48.89,15.7) v2(48.89,11.7) v2(49.89,18.7) v2(49.89,16.7) v2(49.89,11.7) v2(50.89,18.7) v2(50.89,16.7) v2(50.89,11.7) v2(52.89,11.7) v2(52.89,10.7) v2(52.89,1.7) v2(53.89,1.7) v2(54.89,1.7) v2(55.89,10.7)
GND:
  vias: v1(13.29,38.42) v1(13.27,37.02) v1(15.33,38.42) v1(15.33,37.02) v1(20.91,23.94) v1(23.32,37.28) v1(27.26,37.98) v1(27.39,30.93) v1(27.39,29.88) v1(32.59,39.82) v1(33.86,39.82) v1(35.01,39.82) v1(47.96,20.9) v1(50.37,39.95) v1(50.37,39.06) v1(52.02,21.15) v1(56.26,21.15)
PGND:
  vias: v1(12.53,24.83) v1(15.58,31.18) v1(18.5,25.85) v1(20.02,15.05) v2(1,40.23) v2(1,39.23) v2(1,38.23) v2(1,37.23) v2(1,36.23) v2(1,33.23) v2(1,32.23) v2(1,31.23) v2(1,30.23) v2(1,29.23) v2(1,28.23) v2(1,27.23) v2(1,26.23) v2(1,25.23) v2(1,24.23) v2(1,23.23) v2(1,22.23) v2(2,40.23) v2(2,39.23) v2(2,25.23) v2(2,24.23) v2(2,23.23) v2(2,22.23) v2(3,40.23) v2(3.89,26.48) v2(4,40.23) v2(4.15,31.18) v2(5,40.23) v2(5,11.23) v2(6,40.23) v2(6,11.23) v2(7,40.23) v2(7,39.23) v2(7,38.23) v2(7,11.23) v2(8,40.23) v2(8,39.23) v2(8,38.23) v2(8,37.23) v2(8,36.23) v2(8,29.23) v2(8,28.23) v2(8,11.23) v2(9,40.23) v2(9,39.23) v2(9,38.23) v2(9,37.23) v2(9,36.23) v2(9,31.23) v2(9,30.23) v2(9,29.23) v2(9,28.23) v2(9,27.23) v2(9,11.23) v2(10,40.23) v2(10,39.23) v2(10,38.23) v2(10,37.23) v2(10,36.23) v2(10,28.23) v2(10,27.23) v2(10,11.23) v2(11,40.23) v2(11,11.23) v2(12,11.23) v2(13,11.23) v2(14,11.23) v2(15,16.23) v2(15,15.23) v2(15,14.23) v2(15,13.23) v2(15,12.23) v2(15,11.23) v2(16,22.23) v2(16,21.23) v2(17,31.23) v2(17,21.23) v2(17,20.23) v2(17,19.23) v2(18,31.23) v2(19,31.23) v2(20,16.23) v2(21,16.23) v2(24.85,15.18)
VCC: length 10.5
  Top Layer w0.508: LED4.2 10.74,17.5 arc(10.16,17.43) 9.61,17.2 arc(8.74,16.35) SW7.2
  vias: v2(7.62,19.18) v2(8.62,19.18) v2(9.62,19.18) v2(9.62,17.18) v2(9.62,16.18) v2(9.62,15.18) v2(9.62,14.18) v2(9.62,13.18) v2(10.62,19.18) v2(10.62,17.18) v2(10.62,16.18) v2(10.62,14.18) v2(10.62,13.18) v2(11.62,19.18) v2(11.62,17.18) v2(11.62,16.18) v2(11.62,14.18) v2(11.62,13.18) v2(12.62,19.18)
ADC_SAMPLE: length 33.4
  Top Layer w0.254: R49.1 46.95,12.01 U10.1 42.5,12.01 arc(41.87,12.27) 41.61,12.89 41.61,18.61 arc(41.31,19.33) 40.6,19.63 30.56,19.63 arc(30.02,19.85) 29.8,20.39 29.8,21.4 arc(29.54,22.03) 28.91,22.29 27.13,22.29 arc(26.5,22.55) 26.24,23.18 26.24,25.84 arc(26.25,25.85) R54.1
ESP32_EN: length 37.2
  Top Layer w0.254: U12.4 51.28,35.99 v1(50.37,36.9) ; U11.3 v1(35.77,37.26)
  Top Layer w0.508: U11.3 28.13,37.26 27.64,36.77 27.64,35.51 R50.2 27.51,33.65 C40.2 26.44,33.53 25.74,32.83 25.74,28 R58.1
  Bottom Layer w0.254: 35.77,37.28 v1(35.77,37.26) 50.01,37.26 v1(50.37,36.9)
ESP32_IO0: length 12.5
  Top Layer w0.254: U11.25 49.61,23.29 R51.1 50.51,28 v1(50.5,28.01) ; U12.1 52.16,32.2 v1(50.5,32.2)
  Bottom Layer w0.254: v1(50.5,28.01) v1(50.5,32.2)
ESP32_RXD: length 4.6
  Top Layer w0.254: U11.34 49.84,34.72 51.07,33.49 U12.2
ESP32_TXD: length 4.7
  Top Layer w0.254: U11.35 49.82,35.99 51.07,34.74 U12.3
OUT1: length 17
  Top Layer w0.254: U10.7 37.04,13.28 arc(36.5,13.5) 36.28,14.04 R44.2 35.64,15.56 arc(35.19,15.38) 35.01,14.93 35.01,4.61 arc(35.01,4.46) R59.1
OUT2: length 20.5
  Top Layer w0.254: v1(50.5,14.55) R45.2 ; R65.2 50.39,6.67 R68.1 49.57,5.86 U13.7 v1(46.06,5.86)
  Bottom Layer w0.254: v1(50.5,14.55) 46.95,14.55 46.06,13.66 v1(46.06,5.86)
$1N488: length 3.6
  Top Layer w0.254: R12.2 23.19,10.1 arc(23.19,10.1) R14.1 24.97,10.11 arc(24.98,10.11) R13.1
$1N489: length 10.6
  Top Layer w0.254: R11.2 21.8,5.27 arc(22.25,5.46) 22.43,5.91 22.43,8.25 ; 22.43,8.25 20.47,8.25 arc(20.06,8.42) 19.89,8.83 19.89,10.09 arc(19.9,10.1) R12.1 ; 22.43,8.25 arc(22.45,8.3) C14.1
$1N495: length 2
  Top Layer w0.254: C19.2 R11.1
$1N540: length 8.9
  Top Layer w0.254: RF1.5 11.09,5.32 H1.2 C19.1
$1N708: length 2
  Top Layer w0.508: LED4.1 17.61,15.3 R29.1
$1N711:
  vias: v2(2.86,19.13) v2(2.86,18.13) v2(3.86,19.13)
$1N1130: length 1.8
  Top Layer w0.508: C21.2 3.87,23.35 R30.1
$1N1484: length 7.7
  Top Layer w0.508: C24.2 v1(16.08,29.79) ; v1(16.08,24.58) 16.08,25.49 arc(16.17,25.7) U6.3
  Bottom Layer w0.508: v1(16.08,29.79) v1(16.08,24.58)
$1N1485: length 2.3
  Top Layer w0.508: U6.6 19.08,29.26 C24.1
$1N1490: length 1.8
  Top Layer w0.508: U6.5 20.65,26.74 R28.1
$1N1557: length 2.5
  Top Layer w0.508: LED5.1 2.54,30.79 R31.1
$1N1776: length 2.2
  Top Layer w0.508: R3.1 20.14,35.75 LED3.1
$1N5623: length 9.1
  Top Layer w0.254: v1(37.17,14.04) 37.67,14.55 U10.6 ; R43.1 33.6,10.85 arc(33.88,10.97) 33.99,11.24 33.99,12.77 arc(33.92,12.95) R44.3
  Bottom Layer w0.254: v1(37.17,14.04) 34.75,14.04 R44.3
$1N5830: length 4.7
  Top Layer w0.254: U10.3 R45.1 47.46,16.2 arc(47.46,16.2) R46.2
$1N5955: length 5
  Top Layer w0.254: R48.1 52.66,13.02 arc(54.01,13.58) R47.2
$1N5959: length 4.8
  Top Layer w0.254: R48.2 47.46,13.02 arc(47.46,13.02) R49.2 arc(47.38,13.2) 47.19,13.28 U10.2
$1N8059: length 6
  Top Layer w0.254: R52.1 49.89,21.8 U11.24
$1N8471: length 12.3
  Top Layer w0.254: R53.1 56.34,27.63 55.83,28.13 52.41,28.13 50.9,29.64 U11.30
$1N8523: length 2.7
  Top Layer w0.254: R53.2 54.67,24.61 54.31,24.61
$1N8889: length 2.3
  Top Layer w0.254: U11.12 30.06,25.85 R54.2
$1N15972: length 12.8
  Top Layer w0.254: C41.1 arc(28.51,3.97) 28.42,4 24.72,4 arc(24.14,4.24) 23.9,4.82 C14.2 25.99,8.32 arc(26.35,8.47) 26.5,8.83 26.5,10.09 arc(26.5,10.1) R13.2
$1N16222: length 2.2
  Top Layer w0.254: R57.1 38.7,16.15 arc(38.8,15.91) U10.5
$1N16765: length 3.8
  Top Layer w0.508: R58.2 24.35,25.34 C43.1 22.69,23.46 SW1.3
$1N16886: length 8.1
  Top Layer w0.254: C41.2 33.09,3.88 arc(33.1,3.88) R55.2 33.1,9.09 arc(33.11,9.25) R43.2
$1N17273: length 4.2
  Top Layer w0.254: U13.3 40.99,4.59 40.47,4.08 arc(40.46,4.04) 40.42,4.02 C46.2
$1N17414: length 4.8
  Top Layer w0.254: U13.2 42.53,5.99 R69.2 39.08,7.36 R62.1
$1N17487: length 13.2
  Top Layer w0.254: R63.1 44.79,0.58 39.58,0.58 38.69,1.46 C46.1 arc(38.69,2.61) 38.68,2.61 C47.2 36.6,4.33 arc(36.61,4.37) R59.2
$1N17494: length 17.9
  Top Layer w0.254: U13.1 41.48,7.13 R62.2 ; U13.1 v1(44.4,7.13) ; U13.1 42.65,8.48 42.88,8.7 44.03,8.7 R64.1 ; v1(48.72,1.72) R63.2
  Bottom Layer w0.254: v1(44.4,7.13) 44.4,2.23 44.91,1.72 v1(48.72,1.72)
$1N17602: length 18.2
  Top Layer w0.254: v1(55.33,5.02) 53.87,5.02 C49.2 53.78,4.97 R65.1 51.89,3.3 C48.1 ; R64.2 v1(46.82,8.83)
  Bottom Layer w0.254: v1(46.82,8.83) 54.44,8.83 55.33,7.94 v1(55.33,5.02)
$1N17715: length 4.1
  Top Layer w0.254: R67.2 50.38,3.19 C48.2 48.28,3.24 U13.5
$1N17735: length 14.2
  Top Layer w0.254: v1(52.02,7.94) 52.02,6.81 R68.2 53.69,6.67 R70.2 ; U13.6 v1(46.18,4.59)
  Bottom Layer w0.254: v1(52.02,7.94) 52.02,5.15 51.47,4.59 v1(46.18,4.59)

## Copper pours and planes (outline as drawn; the poured copper is in the pictures)
AGND on Top Layer: -4.11,9.97 19.01,9.97 19.01,14.04 25.87,14.04 25.87,20.42 29.58,20.42 29.58,19.34 60.53,19.34 60.53,-7.3 -4.11,-7.3
AGND on Bottom Layer: -4.31,9.98 18.8,9.98 18.8,14.04 25.67,14.04 25.67,20.42 29.38,20.42 29.38,19.35 60.33,19.35 60.33,-7.3 -4.31,-7.3
GND on Top Layer: 12.15,43.88 12.15,34.61 19.89,34.61 19.89,17.59 25.51,17.59 25.64,17.72 25.64,20.64 29.8,20.64 29.8,20.64 29.8,19.54 63.07,19.54 63.07,43.88
GND on Bottom Layer: 12.21,43.95 12.21,34.68 19.96,34.68 19.96,17.66 25.58,17.66 25.7,17.78 25.7,20.71 29.86,20.71 29.86,20.71 29.86,19.6 63.14,19.6 63.14,43.95
PGND on Top Layer: -5,10.23 18.75,10.23 18.75,14.29 25.48,14.29 25.48,17.34 19.72,17.34 19.72,34.36 11.89,34.36 11.89,42.1 -5,42.1
PGND on Bottom Layer: -5,10.29 18.75,10.29 18.75,14.36 25.48,14.36 25.48,17.4 19.72,17.4 19.72,34.42 11.89,34.42 11.89,42.17 -5,42.17
VCC on Top Layer: 6.62,23 13.49,23 13.49,12.18 6.62,12.18
VCC on Bottom Layer: 6.68,23 13.55,23 13.55,12.18 6.68,12.18
$1N711 on Top Layer: 1.86,21.25 4.53,21.25 4.53,11.88 1.86,11.88
$1N711 on Bottom Layer: 1.92,21.14 4.59,21.14 4.59,11.76 1.92,11.76
$1N1033 on Top Layer: 5.8,27.53 7.7,27.53 7.7,26.11 10.79,26.11 10.79,24.29 10.88,24.2 4.82,24.2 4.82,25.92 5.8,25.92
$1N1033 on Bottom Layer: 5.78,27.52 7.68,27.52 7.68,26.09 10.77,26.09 10.77,24.27 10.86,24.18 4.8,24.18 4.8,25.91 5.78,25.91

Small or netless copper shapes (teardrops, artwork), in the pictures only: 205 on Top Layer, 19 on Bottom Layer

## Text on the board
Bottom Silkscreen Layer: Khz_Audio_Board / 280-9000HZ | GND | RX | EN | TX | IO0
Top Silkscreen Layer: 5V | 3.3 | +5V | IN | -5V | OPA657 | T1 | RST | GND | IO27 | T2 | BANDPA | HPA | ESP32WROOM | T3 | T5 | LF353 | T4 | DEBUG | IO18 | 3V3 | OPA2182
